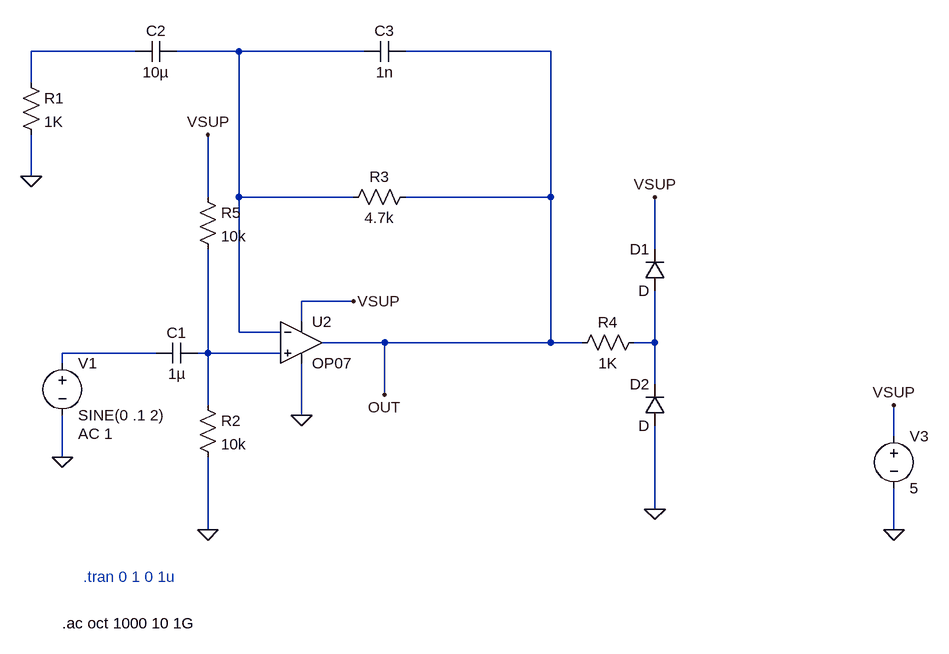
[diagram p0: schematic opamp.asc]
opamp.asc, the LTspice schematic file:
Version 4.1
SHEET 1 1264 760
WIRE 32 -192 -128 -192
WIRE 192 -192 96 -192
WIRE 384 -192 192 -192
WIRE 672 -192 448 -192
WIRE -128 -144 -128 -192
WIRE -128 0 -128 -64
WIRE 144 32 144 -64
WIRE 192 32 192 -192
WIRE 368 32 192 32
WIRE 672 32 672 -192
WIRE 672 32 448 32
WIRE 832 112 832 32
WIRE 368 192 288 192
WIRE 288 224 288 192
WIRE 192 240 192 32
WIRE 256 240 192 240
WIRE 416 256 320 256
WIRE 672 256 672 32
WIRE 672 256 416 256
WIRE 720 256 672 256
WIRE 832 256 832 176
WIRE 832 256 800 256
WIRE 64 272 -80 272
WIRE 144 272 144 112
WIRE 144 272 128 272
WIRE 256 272 144 272
WIRE -80 288 -80 272
WIRE 832 320 832 256
WIRE 416 336 416 256
WIRE 144 352 144 272
WIRE 288 368 288 288
WIRE 1200 400 1200 352
WIRE -80 432 -80 368
WIRE 832 512 832 384
WIRE 144 544 144 432
WIRE 1200 544 1200 480
FLAG -80 432 0
FLAG 1200 544 0
FLAG 1200 352 VSUP
FLAG 368 192 VSUP
FLAG 416 336 OUT
FLAG 288 368 0
FLAG 832 512 0
FLAG 832 32 VSUP
FLAG 144 544 0
FLAG 144 -64 VSUP
FLAG -128 0 0
SYMBOL voltage -80 272 R0
WINDOW 123 24 124 Left 2
WINDOW 39 0 0 Left 0
SYMATTR Value2 AC 1
SYMATTR InstName V1
SYMATTR Value SINE(0 .1 2)
SYMBOL res 464 16 R90
WINDOW 0 0 56 VBottom 2
WINDOW 3 32 56 VTop 2
SYMATTR InstName R3
SYMATTR Value 4.7k
SYMBOL voltage 1200 384 R0
WINDOW 123 0 0 Left 0
WINDOW 39 0 0 Left 0
SYMATTR InstName V3
SYMATTR Value 5
SYMBOL res -144 -160 R0
SYMATTR InstName R1
SYMATTR Value 1K
SYMBOL res 816 240 R90
WINDOW 0 0 56 VBottom 2
WINDOW 3 32 56 VTop 2
SYMATTR InstName R4
SYMATTR Value 1K
SYMBOL diode 848 176 R180
WINDOW 0 24 64 Left 2
WINDOW 3 24 0 Left 2
SYMATTR InstName D1
SYMBOL diode 848 384 R180
WINDOW 0 24 64 Left 2
WINDOW 3 24 0 Left 2
SYMATTR InstName D2
SYMBOL cap 128 256 R90
WINDOW 0 0 32 VBottom 2
WINDOW 3 32 32 VTop 2
SYMATTR InstName C1
SYMATTR Value 1µ
SYMBOL res 128 336 R0
SYMATTR InstName R2
SYMATTR Value 10k
SYMBOL res 128 16 R0
SYMATTR InstName R5
SYMATTR Value 10k
SYMBOL OpAmps\\OP07 288 192 R0
SYMATTR InstName U2
SYMBOL cap 96 -208 R90
WINDOW 0 0 32 VBottom 2
WINDOW 3 32 32 VTop 2
SYMATTR InstName C2
SYMATTR Value 10µ
SYMBOL cap 448 -208 R90
WINDOW 0 0 32 VBottom 2
WINDOW 3 32 32 VTop 2
SYMATTR InstName C3
SYMATTR Value 1n
TEXT -80 688 Left 2 !.ac oct 1000 10 1G
TEXT -48 616 Left 2 ;.tran 0 1 0 1u

The netlist it stands for:
* opamp.asc
V1 N004 0 SINE(0 .1 2) AC 1
R3 OUT N002 4.7k
V3 VSUP 0 5
R1 N001 0 1K
R4 N003 OUT 1K
D1 N003 VSUP D
D2 0 N003 D
C1 N005 N004 1µ
R2 N005 0 10k
R5 VSUP N005 10k
X§U2 N005 N002 VSUP 0 OUT LT1001  ; OP07, pins In+ In- V+ V- OUT
C2 N002 N001 10µ
C3 OUT N002 1n
.model D D
.lib standard.dio
.ac oct 1000 10 1G
* .tran 0 1 0 1u
.lib LTC.lib
.backanno
.end